# Altium schematic sheet DC-link.SchDoc
size A4; CompanyName: Technische Hochschule Nürnberg Georg Simon Ohm; Organization: UltraZohm; Address1: Kesslerplatz 12; Address2: 90489 Nürnberg; Address3: GERMANY; SheetNumber: 6; SheetTotal: 9; Website: www.ultrazohm.com
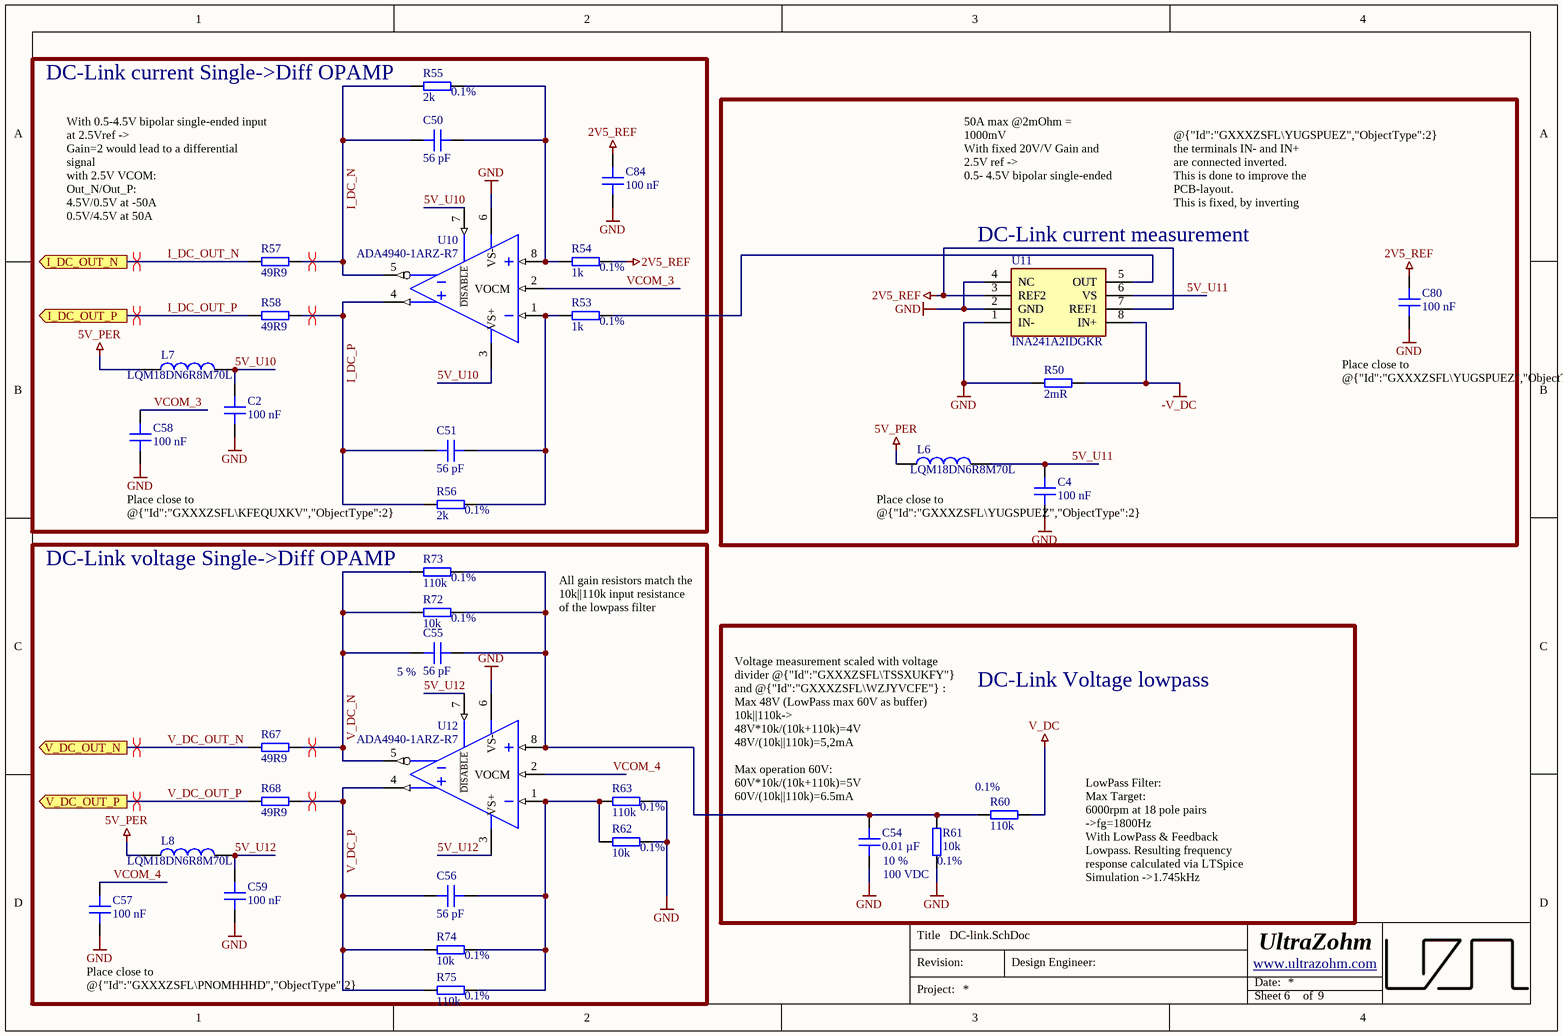
[diagram p0: DC-link.SchDoc]

## Parts
C2  100 nF  [C_0603]
C4  100 nF  [C_0603]
C50  56 pF  [C_0603]
C51  56 pF  [C_0603]
C54  0.01 µF  Tolerance: 10 %  Voltage Rating: 100 VDC  [C_0805]
C55  56 pF  Tolerance: 5 %  [C_0603]
C56  56 pF  [C_0603]
C57  100 nF  [C_0603]
C58  100 nF  [C_0603]
C59  100 nF  [C_0603]
C80  100 nF  [C_0603]
C84  100 nF  [C_0603]
L6  LQM18DN6R8M70L  [INDC1608X95N]
L7  LQM18DN6R8M70L  [INDC1608X95N]
L8  LQM18DN6R8M70L  [INDC1608X95N]
R50  2mR  [3921]
R53  1k  Tolerance: 0.1%  [RES 0603_1608]
R54  1k  Tolerance: 0.1%  [RES 0603_1608]
R55  2k  Tolerance: 0.1%  [RES 0603_1608]
R56  2k  Tolerance: 0.1%  [RES 0603_1608]
R57  49R9  [RES 0603_1608]
R58  49R9  [RES 0603_1608]
R60  110k  Tolerance: 0.1%  [RES 0603_1608]
R61  10k  [RES 0603_1608]
R62  10k  Tolerance: 0.1%  [RES 0603_1608]
R63  110k  Tolerance: 0.1%  [RES 0603_1608]
R67  49R9  [RES 0603_1608]
R68  49R9  [RES 0603_1608]
R72  10k  Tolerance: 0.1%  [RES 0603_1608]
R73  110k  Tolerance: 0.1%  [RES 0603_1608]
R74  10k  Tolerance: 0.1%  [RES 0603_1608]
R75  110k  Tolerance: 0.1%  [RES 0603_1608]
U10  ADA4940-1ARZ-R7  [SOT127P600X175-8N]
U11  INA241A2IDGKR  [SOP65P490X110-8N]
U12  ADA4940-1ARZ-R7  [SOT127P600X175-8N]

## Blocks framed on the sheet
DC-Link current Single->Diff OPAMP: C2 C50 C51 C58 C84 L7 R53-R58 U10
DC-Link current measurement: C4 C80 L6 R50 U11
DC-Link voltage Single->Diff OPAMP: C55-C57 C59 L8 R62 R63 R67 R68 R72-R75 U12
DC-Link Voltage lowpass: C54 R60 R61

## Ports
I_DC_OUT_N (out), I_DC_OUT_P (out), V_DC_OUT_N (out), V_DC_OUT_P (out)

## Nets
2V5_REF: C80.2 C84.2 R54.2 U11.3(REF2) U11.7(REF1)
5V_PER: L6.1 L7.1 L8.1
-V_DC: R50.2 U11.8(IN+)
GND: C2.1 C4.1 C54.1 C57.1 C58.1 C59.1 C80.1 C84.1 R50.1 R61.1 R62.1 R63.2 U10.6(VS-) U11.1(IN-) U11.2(GND) U11.4(NC) U12.6(VS-)
V_DC: R60.2
5V_U10: C2.2 L7.2 U10.3(VS+) U10.7(~{DISABLE})
5V_U11: C4.2 L6.2 U11.6(VS)
5V_U12: C59.2 L8.2 U12.3(VS+) U12.7(~{DISABLE})
I_DC_N: C50.1 R55.1 R57.2 U10.5(VOUT-)
I_DC_OUT_N: R57.1 ; port I_DC_OUT_N
I_DC_OUT_P: R58.1 ; port I_DC_OUT_P
I_DC_P: C51.2 R56.2 R58.2 U10.4(VOUT+)
V_DC_N: C55.1 R67.2 R72.2 R73.1 U12.5(VOUT-)
V_DC_OUT_N: R67.1 ; port V_DC_OUT_N
V_DC_OUT_P: R68.1 ; port V_DC_OUT_P
V_DC_P: C56.2 R68.2 R74.2 R75.1 U12.4(VOUT+)
VCOM_3: C58.2 U10.2(VOCM)
VCOM_4: C57.2 U12.2(VOCM)
NetC50_2: C50.2 R54.1 R55.2 U10.8(VIN+)
NetC51_1: C51.1 R53.1 R56.1 U10.1(VIN-)
NetC54_2: C54.2 C55.2 R60.1 R61.2 R72.1 R73.2 U12.8(VIN+)
NetC56_1: C56.1 R62.2 R63.1 R74.1 R75.2 U12.1(VIN-)
NetR53_2: R53.2 U11.5(OUT)

## Layout directives
differential pair: I_DC_N, I_DC_OUT_N, I_DC_OUT_P, I_DC_P, V_DC_N, V_DC_OUT_N, V_DC_OUT_P, V_DC_P

## Notes on the sheet
- (near R57) With 0.5-4.5V bipolar single-ended input at 2.5Vref ->
  Gain=2 would lead to a differential signal
  with 2.5V VCOM:
  Out_N/Out_P:
  4.5V/0.5V at -50A
  0.5V/4.5V at 50A
- 50A max @2mOhm = 1000mV
  With fixed 20V/V Gain and 2.5V ref ->
  0.5- 4.5V bipolar single-ended
- @{"Id":"GXXXZSFL\YUGSPUEZ","ObjectType":2} the terminals IN- and IN+ are connected inverted. This is done to improve the PCB-layout.
  This is fixed, by inverting the inputs at @{"Id":"GXXXZSFL\KFEQUXKV","ObjectType":2} again.
- (near C80) Place close to @{"Id":"GXXXZSFL\YUGSPUEZ","ObjectType":2} REF inputs
- (near C58) Place close to @{"Id":"GXXXZSFL\KFEQUXKV","ObjectType":2} OPAMP
- Place close to @{"Id":"GXXXZSFL\YUGSPUEZ","ObjectType":2} OPAMP
- All gain resistors match the 10k||110k input resistance of the lowpass filter
- Voltage measurement scaled with voltage divider @{"Id":"GXXXZSFL\TSSXUKFY"} and @{"Id":"GXXXZSFL\WZJYVCFE"} :
  Max 48V (LowPass max 60V as buffer)
  10k||110k->
  48V*10k/(10k+110k)=4V
  48V/(10k||110k)=5,2mA
  Max operation 60V:
  60V*10k/(10k+110k)=5V
  60V/(10k||110k)=6.5mA
- (near R61) 0.1%
- LowPass Filter:
  Max Target:
  6000rpm at 18 pole pairs
  ->fg=1800Hz
  With LowPass & Feedback Lowpass. Resulting frequency response calculated via LTSpice Simulation ->1.745kHz
- Place close to @{"Id":"GXXXZSFL\PNOMHHHD","ObjectType":2} OPAMP
- Title
- Revision:
- Design Engineer:
- Date:
- Project:
- Sheet
- of

## Library data of the parts
C2 C4 C57-C59 C80 C84 = C1608X7S2A104KT000N: 100V 100nF X7S ±10% 0603 Multilayer Ceramic Capacitors MLCC - SMD/SMT ROHS; Manufacturer: TDK; Voltage Rating: 100 VDC; Created from: AGeiger; Manufacturer Part Number: C1608X7S2A104KT000N; PartID: 148; Created On: 20.12.2020 13:54:13; ComponentLink1Description: Datasheet; ComponentLink1URL: https://datasheet.lcsc.com/lcsc/2304140030_TDK-C1608X7S2A104KT000N_C343025.pdf; Component Type: Capacitor 0603; Device Package: 0603; Last Updated: 14.12.2022 12:14:21; Mounting Type: SMD; Operating Temperature: -55 to 125°C; Series: X7R; Supplier 1: LCSC; Supplier Part Number 1: C343025; Type: Capacitor; Tolerance: 10 %; Value: 100 nF; Live Cycle Status: 1; Stock number: not stored; LCSC Part Number: C343025
C50 C51 C56 = CL10C560JB8NNNC: Capacitor 0603, 50 VDC, 56 pF, C0G; Manufacturer: Samsung Electro-Mechanics; Tolerance: 5 %; Voltage Rating: 50 VDC; Created from: DHufnagel; Manufacturer Part Number: CL10C560JB8NNNC; PartID: 92; Created On: 20.12.2020 13:54:13; ComponentLink1Description: Datasheet; ComponentLink1URL: https://www.mouser.de/datasheet/2/585/MLCC-1837944.pdf; Component Type: Capacitor 0603; Device Package: 0603; Last Updated: 20.12.2020 16:24:16; Mounting Type: SMD; Operating Temperature: -55 - 125°C; Series: CL; Supplier 1: Mouser; Supplier Part Number 1: 187-CL10C560JB8NNNC; Supplier 2: LCSC; Supplier Part Number 2: C39148; Type: Capacitor; Value: 56 pF; Live Cycle Status: 1; LCSC Part Number: C39148; Stock number: not stored
C54 = HV0805X7R103K101NT: 100V 10nF 0805 Multilayer Ceramic Capacitors MLCC - SMD/SMT ROHS; Manufacturer: AIDE; Created from: KIlhan; Manufacturer Part Number: HV0805X7R103K101NT; PartID: 128; Created On: 05.07.2023 15:42:28; ComponentLink1Description: Datasheet; ComponentLink1URL: https://datasheet.lcsc.com/lcsc/2103311437_AIDE-HV1210X7R332K202NT_C2691813.pdf; Component Type: Capacitor 0805; Device Package: 0805; Last Updated: 05.07.2023 15:42:28; Mounting Type: SMD; Operating Temperature: -55 - 125°C; Series: C; Supplier 1: JLCPCB; Supplier Part Number 1: HV0805X7R103K101NT; Type: Capacitor; Value: 0.01 µF; Live Cycle Status: 1; Stock number: not stored; LCSC Part Number: C2691724
C55 = CL10C560JB8NNNC: Capacitor 0603, 50 VDC, 56 pF, C0G; Manufacturer: Samsung Electro-Mechanics; Voltage Rating: 50 VDC; Created from: DHufnagel; Manufacturer Part Number: CL10C560JB8NNNC; PartID: 92; Created On: 20.12.2020 13:54:13; ComponentLink1Description: Datasheet; ComponentLink1URL: https://www.mouser.de/datasheet/2/585/MLCC-1837944.pdf; Component Type: Capacitor 0603; Device Package: 0603; Last Updated: 20.12.2020 16:24:16; Mounting Type: SMD; Operating Temperature: -55 - 125°C; Series: CL; Supplier 1: Mouser; Supplier Part Number 1: 187-CL10C560JB8NNNC; Type: Capacitor; Value: 56 pF; Live Cycle Status: 1; Stock number: not stored; Supplier 2: LCSC; Supplier Part Number 2: C39148; LCSC Part Number: C39148
L6-L8 = LQM18DN6R8M70L: 6.8µH, 120mA, 0603, 740mOhm, 20%; Manufacturer: Murata; MF: EPCOS / TDK; Value: 6.8uH; DCR: 320m; Rated Current: 0.85 A; Type: fixed inductor; Created from: DHufnagel; MPN: B82464G4154M; Supplier 1: Mouser; Supplier Part Number 1: 81-LQM18DN6R8M70L; Manufacturer Part Number: LQM18DN6R8M70L; PartID: 10; Created On: 19.07.2022 15:47:17; ComponentLink1Description: Datasheet; ComponentLink1URL: https://www.mouser.de/datasheet/2/281/1/JELF243B_0086-2298241.pdf; Component Type: SMD fixed inductor; Device Package: SMD; Last Updated: 15.06.2023 16:03:16; Mounting Type: SMD; Operating Temperature: -40 - 125°C; Series: LQM18DN_70; Supplier 2: Digi-Key; Supplier Part Number 2: 490-LQM18DN6R8M70LCT-ND; DC current: 120mA; Live Cycle Status: 1; Stock number: not stored; LCSC Part Number: C1881372
R50 = PU3921FKMP50R002L: Shunt resistor 2mOhm, 5W, 1%; Manufacturer Part Number: WSL39212L000FEA; Manufacturer: Vishay; Created from: DHufnagel; PartID: 236; Created On: 12.07.2022 07:38:48; ComponentLink1Description: Datasheet; ComponentLink1URL: https://www.mouser.de/datasheet/2/447/PYu_PU_51_RoHS_L_8-3003083.pdf; Component Type: Shunt SMD resistor; Device Package: 3921; Last Updated: 16.06.2023 12:23:12; Mounting Type: SMD; Supplier 1: Mouser; Supplier Part Number 1: 71-WSL39212L000FEA; Type: Shunt; Tolerance: 1%; Value: 2mR; Live Cycle Status: 1; Stock number: not stored; LCSC Part Number: C844494
R53 R54 = PCF-W0603LF-03-1001-B-P-LT: SMD resistor 0.1%; Manufacturer: IRC / TT Electronics; Created from: MGremer; Manufacturer Part Number: PCF-W0603LF-03-1001-B-P-LT; PartID: 163; Created On: 14.12.2020 16:17:14; ComponentLink1Description: Datasheet; ComponentLink1URL: https://www.mouser.de/datasheet/2/414/PCF-1528243.pdf; Component Type: SMD resistor; Device Package: 0603; Last Updated: 21.02.2024 15:45:55; Mounting Type: SMD; Supplier 1: Mouser; Supplier Part Number 1: 66-PCFW0603LF031001B; Type: Resistor; Value: 1k; Live Cycle Status: 1; Stock number: not stored; LCSC Part Number: C110776
R55 R56 = ERJ-PB3B2001V: SMD resistor 0.1%; Manufacturer: Panasonic; Created from: DHufnagel; Manufacturer Part Number: ERJ-PB3B2001V; PartID: 215; Created On: 14.12.2020 16:17:14; ComponentLink1Description: Datasheet; ComponentLink1URL: https://www.mouser.de/datasheet/2/315/AOA0000C328-1530132.pdf; Component Type: SMD resistor; Device Package: 0603; Last Updated: 02.03.2021 14:07:32; Mounting Type: SMD; Supplier 1: Mouser; Supplier Part Number 1: 667-ERJ-PB3B2001V; Supplier 2: LCSC; Supplier Part Number 2: C189729; Type: Resistor; Value: 2k; Live Cycle Status: 1; Stock number: not stored; LCSC Part Number: C189729
R57 R58 R67 R68 = RK73H1JTTD49R9F: SMD resistor 1%; Manufacturer: KOA Speer; Created from: DHufnagel; Manufacturer Part Number: RK73H1JTTD49R9F; PartID: 214; Created On: 14.12.2020 16:17:14; ComponentLink1Description: Datasheet; ComponentLink1URL: https://www.mouser.de/datasheet/2/219/RK73H-1825326.pdf; Component Type: SMD resistor; Device Package: 0603; Last Updated: 27.05.2022 13:46:35; Mounting Type: SMD; Supplier 1: Mouser; Supplier Part Number 1: 660-RK73H1JTTD49R9F; Supplier 2: LCSC; Supplier Part Number 2: C160046; Type: Resistor; Tolerance: 1%; Value: 49R9; Live Cycle Status: 1; Stock number: not stored; LCSC Part Number: C160046
R60 R63 R73 R75 = RQ73C1J110KBTD: SMD resistor 0.1%, 10ppm; Manufacturer: TE Connectivity / Holsworthy; Created from: DHufnagel; Manufacturer Part Number: RQ73C1J110KBTD; PartID: 216; Created On: 14.12.2020 16:17:14; ComponentLink1Description: Datasheet; ComponentLink1URL: https://www.mouser.de/datasheet/2/418/5/ENG_DS_1773270_2_B-1533717.pdf; Component Type: SMD resistor; Device Package: 0603; Last Updated: 21.02.2024 16:00:52; Mounting Type: SMD; Supplier 1: Mouser; Supplier Part Number 1: 279-RQ73C1J110KBTD; Type: Resistor; Value: 110k; Live Cycle Status: 1; Stock number: not stored; Supplier 2: LCSC; Supplier Part Number 2: C326736; LCSC Part Number: C326736
R61 R62 R72 R74 = RQ73C1J10KBTD: SMD resistor 0.1%, 10ppm; Manufacturer: TE Connectivity; Created from: DHufnagel; Manufacturer Part Number: RQ73C1J10KBTD; PartID: 231; Created On: 14.12.2020 16:17:14; ComponentLink1Description: Datasheet; ComponentLink1URL: https://www.mouser.de/datasheet/2/418/5/ENG_DS_1773270_2_B-1533717.pdf; Component Type: SMD resistor; Device Package: 0603; Last Updated: 21.02.2024 15:51:17; Mounting Type: SMD; Supplier 1: Mouser; Supplier Part Number 1: 279-RQ73C1J10KBTD; Type: Resistor; Value: 10k; Live Cycle Status: 1; Stock number: not stored; Supplier 2: LCSC; Supplier Part Number 2: C95204; LCSC Part Number: C95204
  R61: Tolerance: 0.1%
U10 U12 = ADA4940-1ARZ-R7: Fully Differential Amplifier, Ultralow-Power,Low Distortion, 260-MHz; Manufacturer: Analog Devices; Channels: 1; GBP: 260 MHz; CMRR: 86 dB; Created from: DHufnagel; Manufacturer Part Number: ADA4940-1ARZ-R7; PartID: 14; Created On: 18.08.2022 12:53:27; ComponentLink1Description: Datasheet; ComponentLink1URL: https://www.mouser.de/datasheet/2/609/ada4940_1_4940_2-2955874.pdf; Component Type: Differential Amplifier; Device Package: SOIC-8; Last Updated: 18.08.2022 13:04:18; Mounting Type: SMD; Operating Temperature: -40 - 105°C; Series: ADA4940-1; Supplier 1: Mouser; Supplier Part Number 1: 584-ADA4940-1ARZ; Supplier 2: Digi-Key; Supplier Part Number 2: 505-ADA4940-1ARZ-ND; Supplier 3: LCSC; Supplier Part Number 3: C730049; Type: Differential Amplifiers; Live Cycle Status: 1; LCSC Part Number: C730049; Stock number: not stored
U11 = INA241A2IDGKR: Current Sense Amplifier, 5-100 V  CMV, 20 V/V, bidirectional; Manufacturer: Texas Instruments; Channels: 1; GBP: 100MHz; CMRR: 89dB; Value: Rail-to-Rail; Created from: KPatel; Manufacturer Part Number: INA241A2IDGKR; PartID: 30; Created On: 6/28/2024 9:00:46 AM; ComponentLink1Description: Datasheet; ComponentLink1URL: https://www.ti.com/lit/ds/symlink/ina241b.pdf?ts=1718088817119&ref_url=https%253A%252F%252Fwww.mouser.de%252F; Component Type: Current Sense Amplifier; Device Package: VSSOP-8; Last Updated: 6/28/2024 9:00:46 AM; Mounting Type: SMD; Operating Temperature: -40 - 125°C; Series: INA241A; Supplier 1: Mouser; Supplier Part Number 1: 595-INA241A2IDGKR; Type: Current Sense Amplifier; Live Cycle Status: 1; Stock number: not stored